# EAGLE design ticktock (EAGLE 6.4)
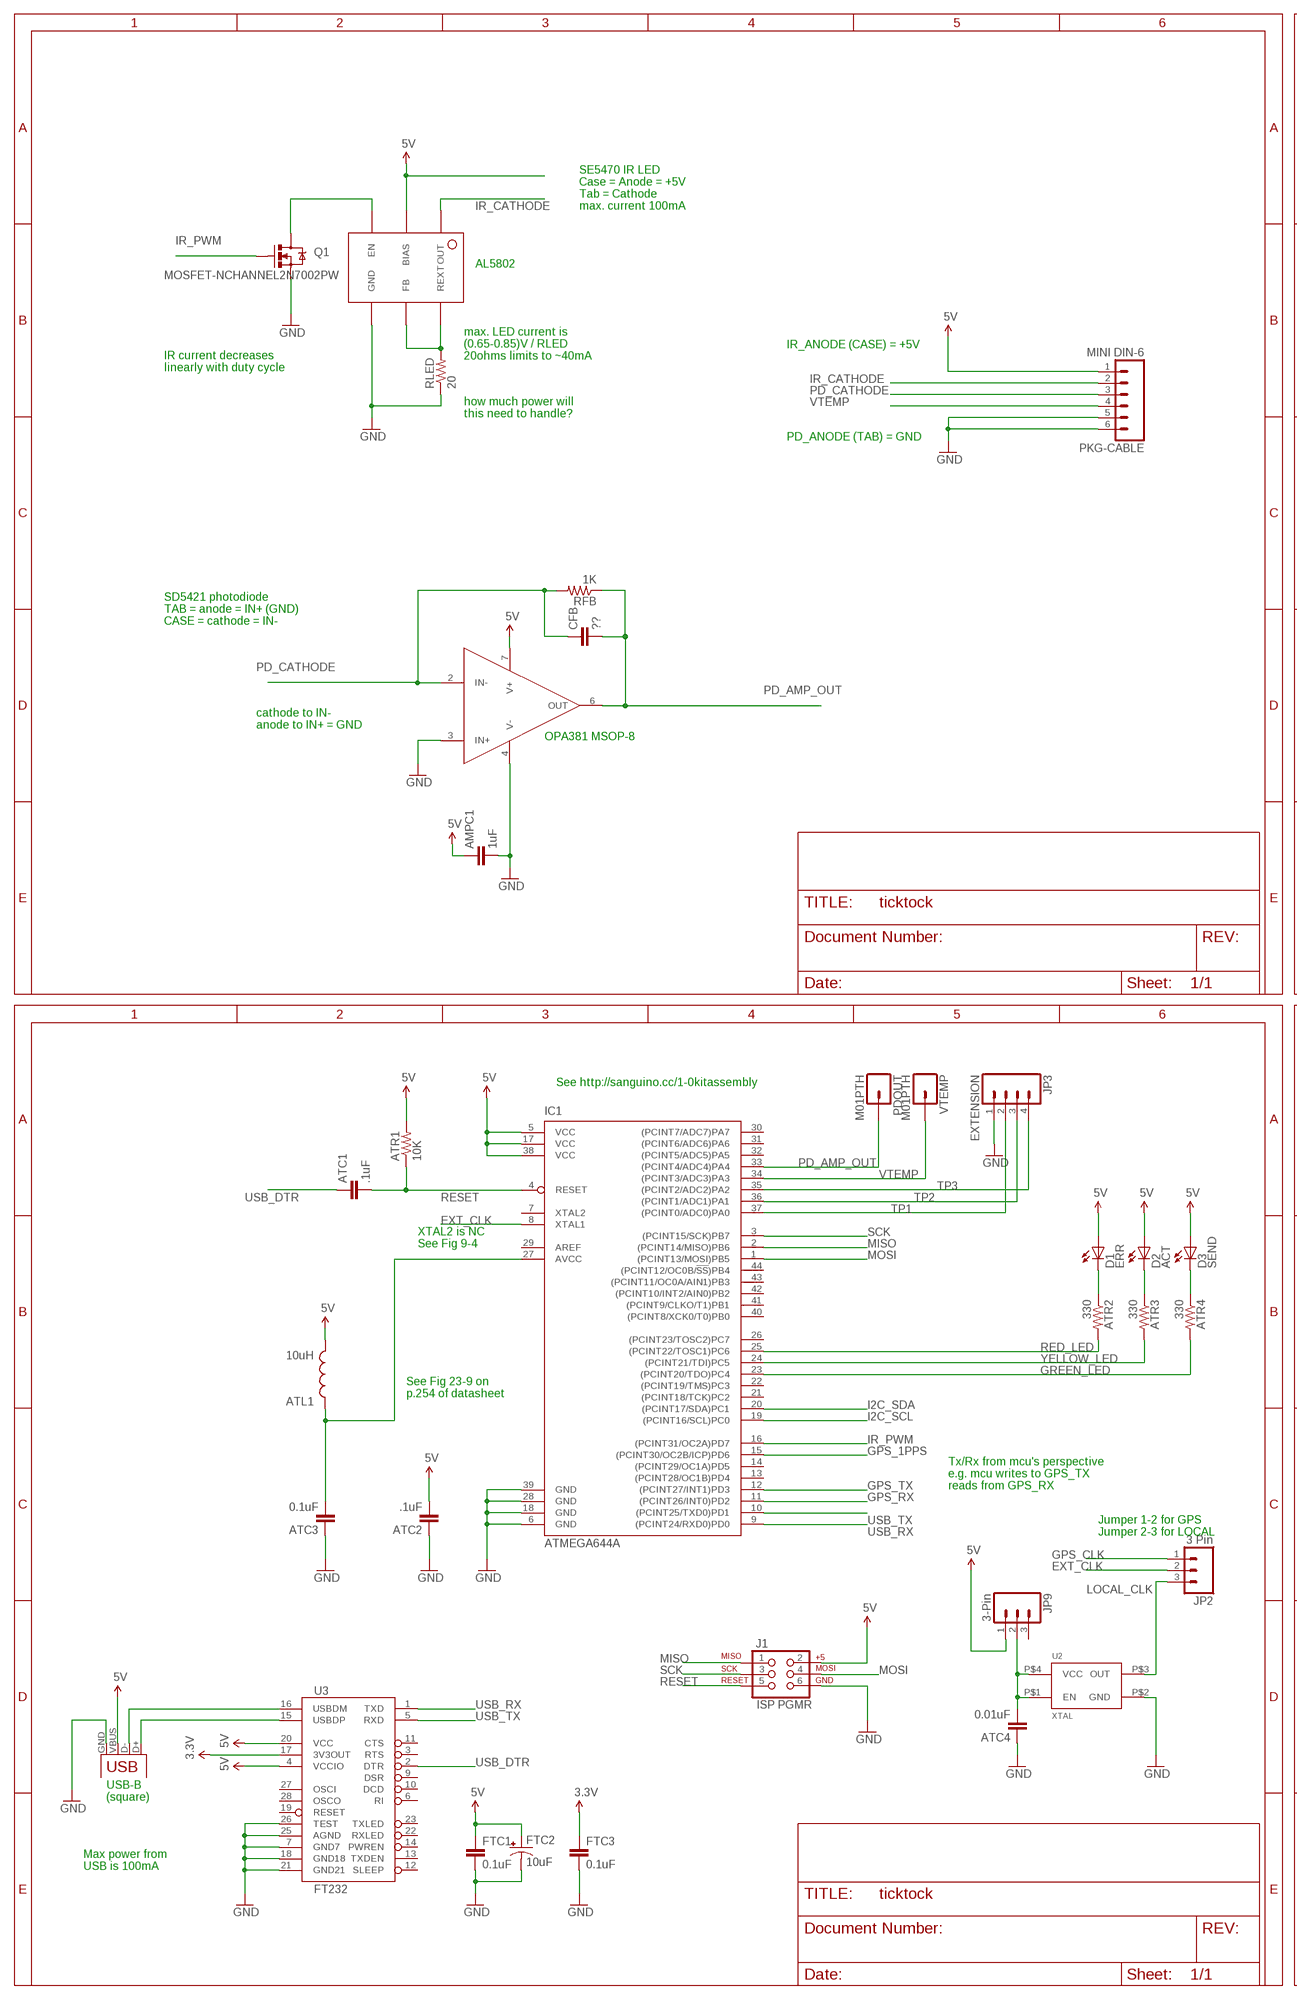
[diagram p0: schematic, sheet 1, part 1 of 2]
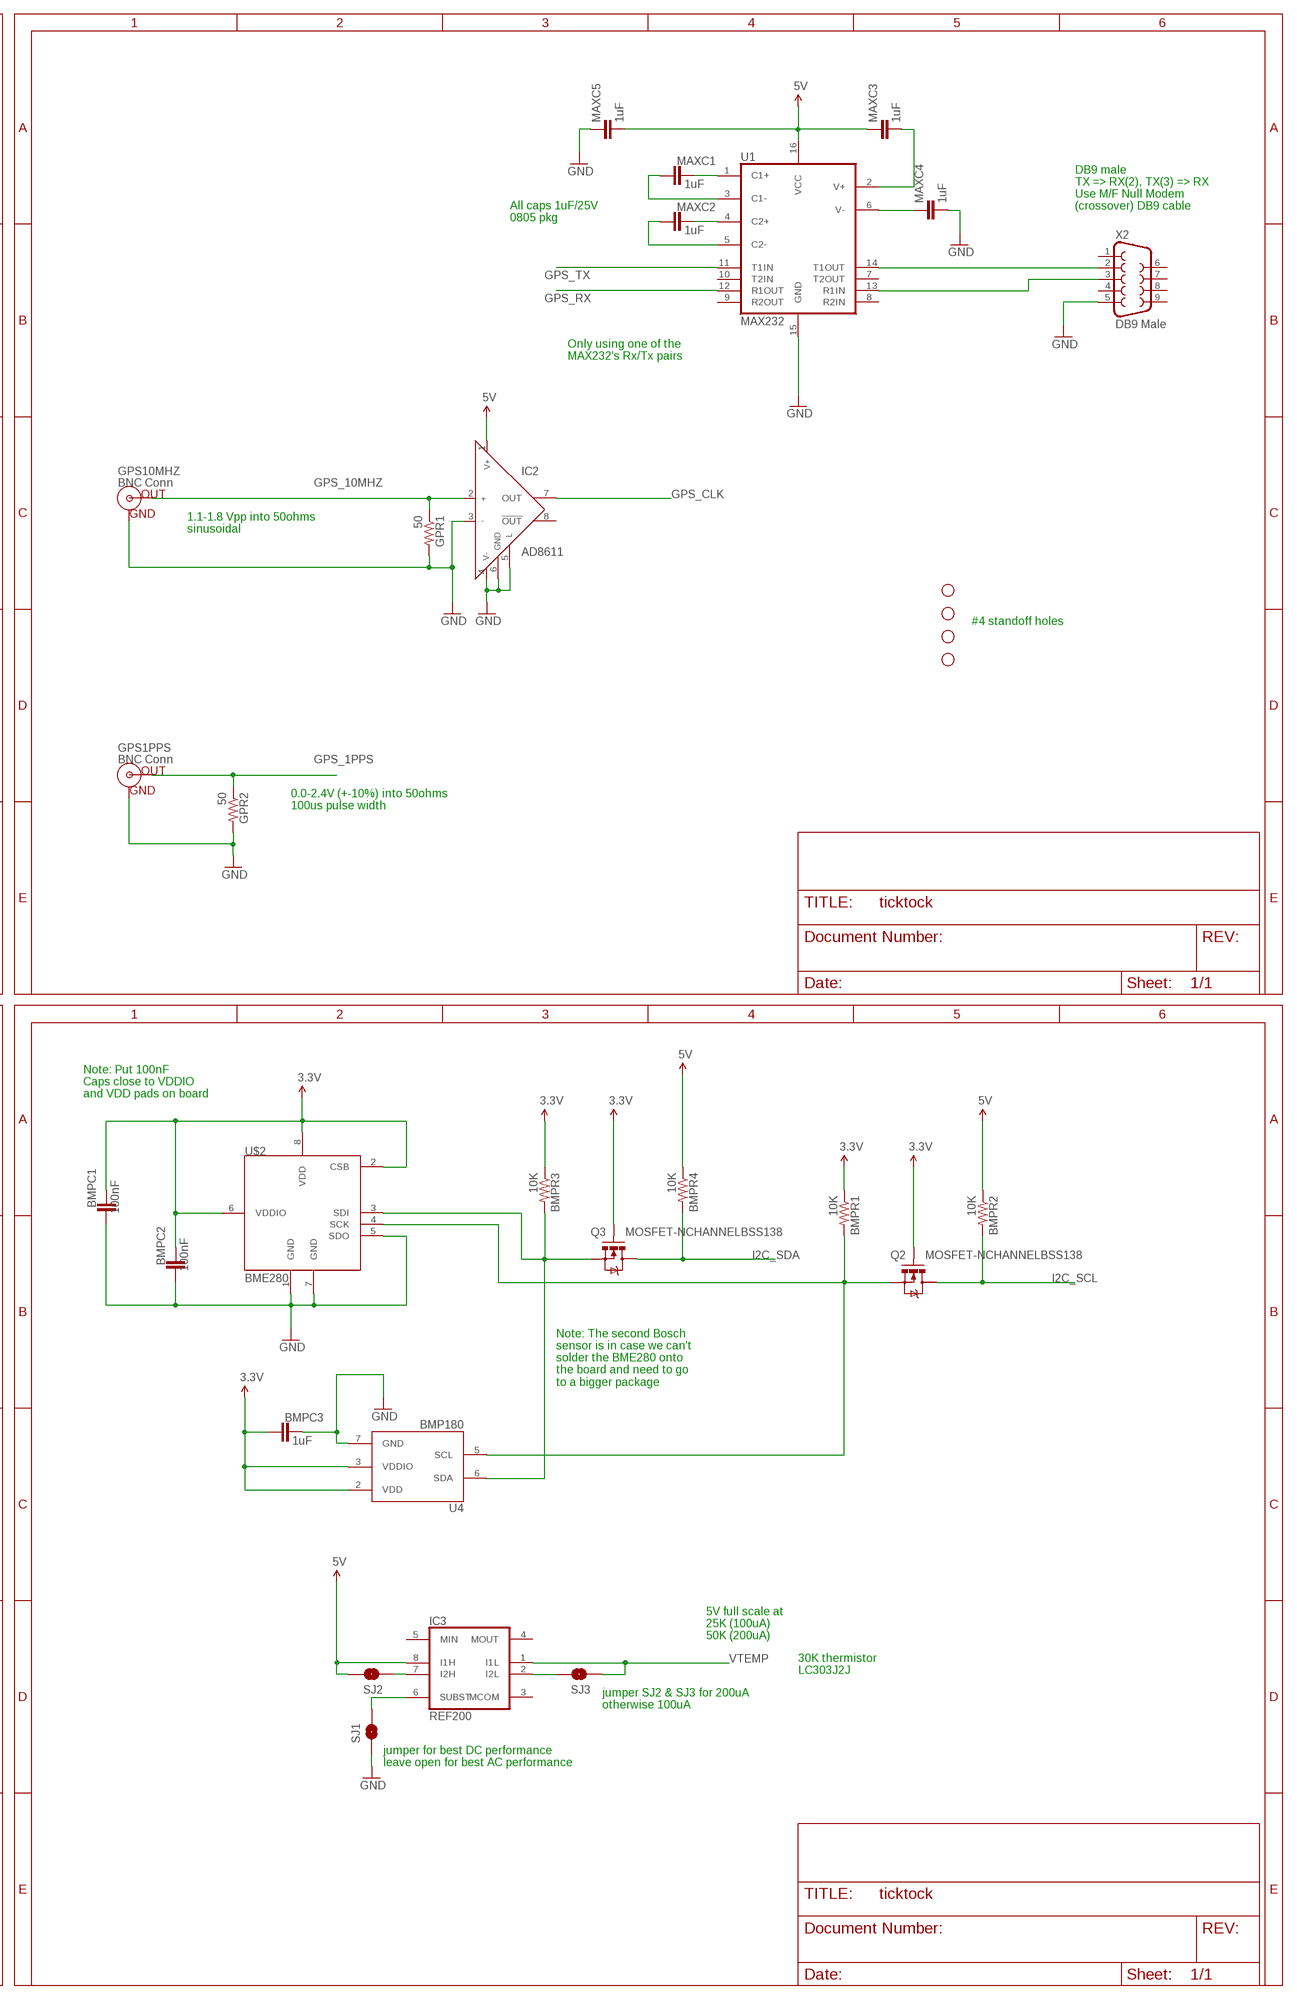
[diagram p1: schematic, sheet 1, part 2 of 2]

## Parts
AMPC1  1uF  CAP0805  [0805]
ATC1  .1uF  CAP0805  [0805]
ATC2  .1uF  CAP0805  [0805]
ATC3  0.1uF  CAP0805  [0805]
ATC4  0.01uF  CAP0805  [0805]
ATL1  10uH  INDUCTOR0805  [0805]
ATR1  10K  RESISTOR0805-RES  [0805]
ATR2  330  RESISTOR0805-RES  [0805]
ATR3  330  RESISTOR0805-RES  [0805]
ATR4  330  RESISTOR0805-RES  [0805]
BMPC1  100nF  CAP0805  [0805]
BMPC2  100nF  CAP0805  [0805]
BMPC3  1uF  CAP0805  [0805]
BMPR1  10K  RESISTOR0805-RES  [0805]
BMPR2  10K  RESISTOR0805-RES  [0805]
BMPR3  10K  RESISTOR0805-RES  [0805]
BMPR4  10K  RESISTOR0805-RES  [0805]
CFB  ??  CAP0805  [0805]
D1  ERR  LED-REDLILYPAD  [LED-1206]
D2  ACT  LED-YELLOWLILYPAD  [LED-1206]
D3  SEND  LED-GREENLILYPAD  [LED-1206]
FTC1  0.1uF  CAP0805  [0805]
FTC2  10uF  CAP_POL1206  [EIA3216]
FTC3  0.1uF  CAP0805  [0805]
GPR1  50  RESISTOR0805-RES  [0805]
GPR2  50  RESISTOR0805-RES  [0805]
GPS1PPS  BNC Conn  BNCPTH  [BNC]
GPS10MHZ  BNC Conn  BNCPTH  [BNC]
IC1  ATMEGA644A  [TQFP44]
IC2  AD8611  AD8611RM  [MSOP08]
IC3  REF200  REF200U  [SO08]
IC4  OPA381  [MSOP08]
IC5  AL5802  AL5802AL5802  [AL5802]
J1  ISP PGMR  AVR_SPI_PRG_6NS  [2X3-NS]
JP1  Square USB  USBPTH  [USB-B-PTH]
JP2  3 Pin  M03LOCK  [1X03_LOCK]
JP3  EXTENSION  M04LOCK  [1X04_LOCK]
JP9  3-Pin  M03LOCK  [1X03_LOCK]
MAXC1  1uF  CAP0805  [0805]
MAXC2  1uF  CAP0805  [0805]
MAXC3  1uF  CAP0805  [0805]
MAXC4  1uF  CAP0805  [0805]
MAXC5  1uF  CAP0805  [0805]
PDOUT  M01PTH  [1X01]
PKG-CABLE  MINI DIN-6  MINI-DIN6PTH  [MINI-DIN6]
Q1  MOSFET-NCHANNEL2N7002PW  [SOT323]
Q2  MOSFET-NCHANNELBSS138  [SOT23]
Q3  MOSFET-NCHANNELBSS138  [SOT23]
RFB  1K  RESISTOR0805-RES  [0805]
RLED  20  RESISTOR0805-RES  [0805]
SJ1  SOLDERJUMPERNO  [SJ_2S-NO]
SJ2  SOLDERJUMPERNO  [SJ_2S-NO]
SJ3  SOLDERJUMPERNO  [SJ_2S-NO]
STANDOFF1  STAND-OFF  [STAND-OFF]
STANDOFF2  STAND-OFF  [STAND-OFF]
STANDOFF3  STAND-OFF  [STAND-OFF]
STANDOFF4  STAND-OFF  [STAND-OFF]
U1  MAX232  MAX232SOIC16  [SO016]
U2  XTAL  OSCILLATORSMD  [CRYSTAL-SMD-7X5]
U3  FT232  FT232RLSSOP  [SSOP28DB]
U4  BMP180  [BMP180]
U$2  BME280  BME280BME280-LGA  [BME280]
VTEMP  M01PTH  [1X01]
X2  DB9 Male  DB9MALE  [DB9_MALE]

## Nets
3.3V: BMPC1.2 BMPC2.2 BMPC3.1 BMPR1.1 BMPR3.1 FTC3.1 Q2.1(G) Q3.1(G) U3.17(3V3OUT) U4.2(VDD) U4.3(VDDIO) U$2.2(CSB) U$2.6(VDDIO) U$2.8(VDD)
5V: AMPC1.1 ATC2.2 ATL1.2 ATR1.2 BMPR2.1 BMPR4.1 D1.A D2.A D3.A FTC1.1 FTC2.A(+) IC1.5(VCC) IC1.17(VCC) IC1.38(VCC) IC2.1(V+) IC3.8(I1H) IC4.7(V+) IC5.BIAS J1.2 JP1.VBUS JP9.1 MAXC3.1 MAXC5.2 PKG-CABLE.1 SJ2.2 U1.16(VCC) U3.4(VCCIO) U3.20(VCC)
EXT_CLK: IC1.8(XTAL1) JP2.2
GND: AMPC1.2 ATC2.1 ATC3.1 ATC4.1 BMPC1.1 BMPC2.1 BMPC3.2 FTC1.2 FTC2.C(-) FTC3.2 GPR1.2 GPR2.2 GPS1PPS.GND GPS10MHZ.GND IC1.6(GND) IC1.18(GND) IC1.28(GND) IC1.39(GND) IC2.3(IN-) IC2.4(V-) IC2.5(L) IC2.6(GND) IC4.3(IN+) IC4.4(V-) IC5.GND J1.6 JP1.GND JP3.1 MAXC4.2 MAXC5.1 PKG-CABLE.5 PKG-CABLE.6 Q1.2(S) RLED.1 SJ1.1 U1.15(GND) U2.P$2(GND) U3.7(GND7) U3.18(GND18) U3.21(GND21) U3.25(AGND) U3.26(TEST) U4.7(GND) U$2.1(GND) U$2.5(SDO) U$2.7(GND) X2.5
GPS_1PPS: GPR2.1 GPS1PPS.S(OUT) IC1.15((PCINT30/OC2B/ICP)PD6)
GPS_10MHZ: GPR1.1 GPS10MHZ.S(OUT) IC2.2(IN+)
GPS_CLK: IC2.7(OUT) JP2.1
GPS_RX: IC1.11((PCINT26/INT0)PD2) U1.12(R1OUT)
GPS_TX: IC1.12((PCINT27/INT1)PD3) U1.11(T1IN)
GREEN_LED: ATR4.2 IC1.23((PCINT20/TDO)PC4)
I2C_SCL: BMPR2.2 IC1.19((PCINT16/SCL)PC0) Q2.3(D)
I2C_SDA: BMPR4.2 IC1.20((PCINT17/SDA)PC1) Q3.3(D)
IR_CATHODE: IC5.OUT PKG-CABLE.2
IR_PWM: IC1.16((PCINT31/OC2A)PD7) Q1.1(G)
LOCAL_CLK: JP2.3 U2.P$3(OUT)
MISO: IC1.2((PCINT14/MISO)PB6) J1.1
MOSI: IC1.1((PCINT13/MOSI)PB5) J1.4
N$1: IC5.EN Q1.3(D)
N$2: IC5.FB IC5.REXT RLED.2
N$3: MAXC1.2 U1.1(C1+)
N$4: MAXC1.1 U1.3(C1-)
N$5: MAXC2.2 U1.4(C2+)
N$6: MAXC2.1 U1.5(C2-)
N$7: MAXC3.2 U1.2(V+)
N$8: U1.14(T1OUT) X2.2
N$9: MAXC4.1 U1.6(V-)
N$10: U1.13(R1IN) X2.3
N$11: JP1.D- U3.16(USBDM)
N$12: JP1.D+ U3.15(USBDP)
N$13: ATC3.2 ATL1.1 IC1.27(AVCC)
N$14: IC3.6(SUBST) SJ1.2
N$15: BMPR1.2 Q2.2(S) U4.5(SCL) U$2.4(SCK)
N$16: ATR4.1 D3.C
N$17: IC3.7(I2H) SJ2.1
N$19: IC3.2(I2L) SJ3.2
N$20: ATR3.1 D2.C
N$21: ATR2.1 D1.C
N$22: ATC4.2 JP9.2 U2.P$1(EN) U2.P$4(VCC)
N$23: BMPR3.2 Q3.2(S) U4.6(SDA) U$2.3(SDI)
PD_AMP_OUT: CFB.2 IC1.33((PCINT4/ADC4)PA4) IC4.6(OUT) PDOUT.1 RFB.1
PD_CATHODE: CFB.1 IC4.2(IN-) PKG-CABLE.3 RFB.2
RED_LED: ATR2.2 IC1.25((PCINT22/TOSC1)PC6)
RESET: ATC1.2 ATR1.1 IC1.4(RESET) J1.5
SCK: IC1.3((PCINT15/SCK)PB7) J1.3
TP1: IC1.37((PCINT0/ADC0)PA0) JP3.2
TP2: IC1.36((PCINT1/ADC1)PA1) JP3.3
TP3: IC1.35((PCINT2/ADC2)PA2) JP3.4
USB_DTR: ATC1.1 U3.2(DTR)
USB_RX: IC1.9((PCINT24/RXD0)PD0) U3.1(TXD)
USB_TX: IC1.10((PCINT25/TXD0)PD1) U3.5(RXD)
VTEMP: IC1.34((PCINT3/ADC3)PA3) IC3.1(I1L) PKG-CABLE.4 SJ3.1 VTEMP.1
YELLOW_LED: ATR3.2 IC1.24((PCINT21/TDI)PC5)
Unconnected: IC1.7(XTAL2) IC1.13((PCINT28/OC1B)PD4) IC1.14((PCINT29/OC1A)PD5) IC1.21((PCINT18/TCK)PC2) IC1.22((PCINT19/TMS)PC3) IC1.26((PCINT23/TOSC2)PC7) IC1.29(AREF) IC1.30((PCINT7/ADC7)PA7) IC1.31((PCINT6/ADC6)PA6) IC1.32((PCINT5/ADC5)PA5) IC1.40((PCINT8/XCK0/T0)PB0) IC1.41((PCINT9/CLKO/T1)PB1) IC1.42((PCINT10/INT2/AIN0)PB2) IC1.43((PCINT11/OC0A/AIN1)PB3) IC1.44((PCINT12/OC0B/!SS!)PB4) IC2.8(!OUT) IC3.3(MCOM) IC3.4(MOUT) IC3.5(MIN) JP9.3 U1.7(T2OUT) U1.8(R2IN) U1.9(R2OUT) U1.10(T2IN) U3.3(RTS) U3.6(RI) U3.9(DSR) U3.10(DCD) U3.11(CTS) U3.12(SLEEP) U3.13(TXDEN) U3.14(PWREN) U3.19(RESET) U3.22(RXLED) U3.23(TXLED) U3.27(OSCI) U3.28(OSCO) X2.1 X2.4 X2.6 X2.7 X2.8 X2.9

## Notes on the sheet
- SE5470 IR LED
  Case = Anode = +5V
  Tab = Cathode
  max. current 100mA
- DB9 male 
  TX => RX(2), TX(3) => RX
  Use M/F Null Modem 
  (crossover) DB9 cable
- All caps 1uF/25V
  0805 pkg
- AL5802
- IR_ANODE (CASE) = +5V
- max. LED current is
  (0.65-0.85)V / RLED
  20ohms limits to ~40mA
- Only using one of the
  MAX232's Rx/Tx pairs
- IR current decreases
  linearly with duty cycle
- how much power will
  this need to handle?
- PD_ANODE (TAB) = GND
- 1.1-1.8 Vpp into 50ohms
  sinusoidal
- SD5421 photodiode
  TAB = anode = IN+ (GND)
  CASE = cathode = IN-
- #4 standoff holes
- cathode to IN-
  anode to IN+ = GND
- OPA381 MSOP-8
- 0.0-2.4V (+-10%) into 50ohms
  100us pulse width
- See http://sanguino.cc/1-0kitassembly
- Note: Put 100nF
  Caps close to VDDIO
  and VDD pads on board
- XTAL2 is NC
  See Fig 9-4
- Note: The second Bosch
  sensor is in case we can't
  solder the BME280 onto
  the board and need to go
  to a bigger package
- See Fig 23-9 on
  p.254 of datasheet
- Tx/Rx from mcu's perspective
  e.g. mcu writes to GPS_TX
  reads from GPS_RX
- Jumper 1-2 for GPS
  Jumper 2-3 for LOCAL
- 5V full scale at
  25K (100uA)
  50K (200uA)
- 30K thermistor
  LC303J2J
- jumper SJ2 & SJ3 for 200uA
  otherwise 100uA
- jumper for best DC performance
  leave open for best AC performance
- USB-B
  (square)
- Max power from
  USB is 100mA

## Library data of the parts
AMPC1 ATC1-ATC4 BMPC1-BMPC3 CFB FTC1 FTC3 MAXC1-MAXC5 = SparkFun-Capacitors:CAP: Capacitor Standard 0603 ceramic capacitor, and 0.1" leaded capacitor.
ATL1 = SparkFun-Passives:INDUCTOR: Inductors Basic Inductor/Choke - 0603 and 1206. Footprints are not proven and vary greatly between part numbers. SRN6045- 33uH, 20% 1.4A SDR0403-560KL - 56uH, 10%, 500mA RMS/740mA peak
ATR1-ATR4 BMPR1-BMPR4 GPR1 GPR2 RFB RLED = SparkFun-Resistors:RESISTOR: Resistor Basic schematic elements and footprints for 0603, 1206, and PTH resistors.
D1 = SparkFun-LED:LED-RED: Assorted Red LEDs LilyPad 1206- DIO-09912 1206- DIO-00809 0603- DIO-00819; PROD_ID: DIO-09912; VALUE: RED
D2 = SparkFun-LED:LED-YELLOW: Yellow SMD LEDs LilyPad 1206- DIO-09909 0603- DIO-09003; PROD_ID: DIO-09909; VALUE: Yellow
D3 = SparkFun-LED:LED-GREEN: Various green LEDs 0603- DIO-00821 LARGE- DIO-00862 LILYPAD- DIO-09910; PROD_ID: DIO-09910; VALUE: GREEN
FTC2 = SparkFun-Capacitors:CAP_POL: Capacitor Polarized These are standard SMD and PTH capacitors. Normally 10uF, 47uF, and 100uF in electrolytic and tantalum varieties. Always verify the external diameter of the through hole cap, it varies with capacity, voltage, and manufacturer. The EIA devices should be standard.
GPS1PPS GPS10MHZ = SparkFun-Connectors:BNC: BNC Connector, Mouser Part# 5227161
IC1 = atmel:ATMEGA644: 8-bit Microcontroller with 64K Bytes In-System Programmable Flash Source: http://www.atmel.com/dyn/resources/prod_documents/doc2593.pdf; MPN: ATMEGA644PV-10AU; OC_FARNELL: 1455123; OC_NEWARK: 58M3748
IC2 = analog-devices:AD8611: Ultrafast 4 ns Single Supply Comparators Source: http://www.analog.com/UploadedFiles/Data_Sheets/703465986AD8611_2_0.pdf Upgrade for LT1394 and LT1016 Designs; MPN: AD8611ARMZ-R2; OC_FARNELL: 1464995; OC_NEWARK: 19M8930
IC3 = burr-brown:REF200: Dual Current Source/Current Sink; MF: TEXAS INSTRUMENTS; MPN: REF200AU; OC_FARNELL: 1207240; OC_NEWARK: 34C7615
IC4 = tickTockLibrary:OPA381
IC5 = tickTockLibrary:AL5802
J1 = SparkFun-Connectors:AVR_SPI_PRG_6: AVR ISP 6 Pin This is the reduced ISP connector for AVR programming. Common on Arduino. This footprint will take up less PCB space and can be used with a 10-pin to 6-pin adapter such as SKU: BOB-08508
JP1 = SparkFun-Connectors:USB: USB Connectors USB-B-PTH is fully proven SKU : PRT-00139/CONN-08278 USB-miniB is fully proven SKU : PRT-00587 USB-A-PCB is untested. USB-A-H is throughly reviewed, but untested. Spark Fun Electronics SKU : PRT-00437 USB-B-SMT is throughly reviewed, but untested. Needs silkscreen touching up. USB-A-S has not been used/tested USB-MB-H has not been used/tested USB-MICROB has been used. CONN-09505; PROD_ID: CONN-08278; VALUE: USB-B
JP2 JP9 = SparkFun-Connectors:M03: Header 3 Standard 3-pin 0.1" header. Use with straight break away headers (SKU : PRT-00116), right angle break away headers (PRT-00553), swiss pins (PRT-00743), machine pins (PRT-00117), and female headers (PRT-00115). Molex polarized connector foot print use with SKU : PRT-08232 with associated crimp pins and housings.
JP3 = SparkFun-Connectors:M04: Header 4 Standard 4-pin 0.1" header. Use with straight break away headers (SKU : PRT-00116), right angle break away headers (PRT-00553), swiss pins (PRT-00743), machine pins (PRT-00117), and female headers (PRT-00115). Molex polarized connector foot print use with SKU : PRT-08231 with associated crimp pins and housings. 1MM SMD Version SKU: PRT-10208
PDOUT VTEMP = SparkFun-Connectors:M01: Header 1 Standard 1-pin 0.1" header. Use with straight break away headers (SKU : PRT-00116), right angle break away headers (PRT-00553), swiss pins (PRT-00743), machine pins (PRT-00117), and female headers (PRT-00115).
PKG-CABLE = SparkFun-Connectors:MINI-DIN6: mini DIN 6 Connector Commonly found on the back of a computer for PS2 keyboard and mice. Schematic and footprint are proven. Spark Fun Electronics SKU : PRT-08509
Q1 = SparkFun-DiscreteSemi:MOSFET-NCHANNEL: Common NMOSFET Parts MFG P/N Store ID Prod ID FDD8780 TRANS-09984 SI7820DN TRANS-11055 FDS6630A IC-08089 2N7002PW TRANS-11151 FQP30N06L COM-10213 TRANS-10060 BSS123LT1G TRANS-08345 BSS138 TRANS-00830 BS170 2N7000; PROD_ID: TRANS-11151
Q2 Q3 = SparkFun-DiscreteSemi:MOSFET-NCHANNEL: Common NMOSFET Parts MFG P/N Store ID Prod ID FDD8780 TRANS-09984 SI7820DN TRANS-11055 FDS6630A IC-08089 2N7002PW TRANS-11151 FQP30N06L COM-10213 TRANS-10060 BSS123LT1G TRANS-08345 BSS138 TRANS-00830 BS170 2N7000; PROD_ID: TRANS-00830
SJ1-SJ3 = SparkFun:SOLDERJUMPER: Solder Jumper Standard SMD solder jumper. Used to automate production. Two varients : Normally Open and Normally Closed are the same, but have different paste layers. NC will have a large amount of paste and should jumper during reflow.
STANDOFF1-STANDOFF4 = SparkFun-Electromechanical:STAND-OFF: #4 Stand Off This is the mechanical footprint for a #4 phillips button head screw. Use the keepout ring to avoid running the screw head into surrounding components. SKU : PRT-00447
U1 = SparkFun-DigitalIC:MAX232: RS232 Transceiver Very common IC. This is generically called 'MAX232', but works with the 3V equivalent MAX3232 generic ICs. Field tested and mother approved. Spark Fun Electronics SKU : COM-00316 (DIP) and COM-00589 (SMD)
U2 = SparkFun-FreqCtrl:OSCILLATOR: Generic 5x3 and 7x5 oscillators
U3 = SparkFun-DigitalIC:FT232RL: USB UART FT232RL 4th Generation USB UART (USB <-> Serial) Controller. Spark Fun Electronics SKU : COM-00650 Production SKU IC-00870; PROD_ID: IC-00870
U4 = SparkFun-Sensors:BMP180: BOSCH BMP180 DIGITAL BAROMETRIC PRESSURE SENSOR Web page: http://www.bosch-sensortec.com/en/homepage/products_3/environmental_sensors_1/bmp180_1/bmp180 Datasheet: http://ae-bst.resource.bosch.com/media/products/dokumente/bmp180/BST-BMP180-DS000-09.pdf The BMP180 is the function compatible successor of the BMP085, a new generation of high precision digital pressure sensors for consumer applications. The ultra-low power, low voltage electronics of the BMP180 is optimized for use in mobile phones, PDAs, GPS navigation devices and outdoor equipment. With a low altitude noise of merely 0.25m at fast conversion time, the BMP180 offers superior performance. The I2C interface allows for easy system integration with a microcontroller. The BMP180 is based on piezo-resistive technology for EMC robustness, high accuracy and linearity as well as long term stability. Key features: - Temperature measurement included - I2C interface - Fully calibrated - Pb-free, halogen-free and RoHS compliant, - MSL 1 Basic specs: Pressure range: 300 to 1100hPa (+9000m to -500m relating to sea level) Supply voltage: 1.8 to 3.6V (VDD), 1.62V to 3.6V (VDDIO) Package: LGA package with metal lid Small footprint: 3.6mm x 3.8mm Super-flat: 0.93mm height Low power: 5μA at 1 sample / sec. in standard mode Low noise: 0.06hPa (0.5m) in ultra low power mode, 0.02hPa (0.17m) advanced resolution mode Typical applications: - Enhancement of GPS navigation (dead-reckoning, slope detection, etc.) - In- and out-door navigation - Leisure and sports - Weather forecast - Vertical velocity indication (rise/sink speed)
U$2 = tickTockLibrary:BME280
X2 = SparkFun-Connectors:DB9: DB9 Connector Standard DB9 (D-Sub 9) serial connector. Can be used for CAN bus as well as RS485 and RS232. Footprint production proven. Spark Fun Electronics SKU : PRT-00429

## Board
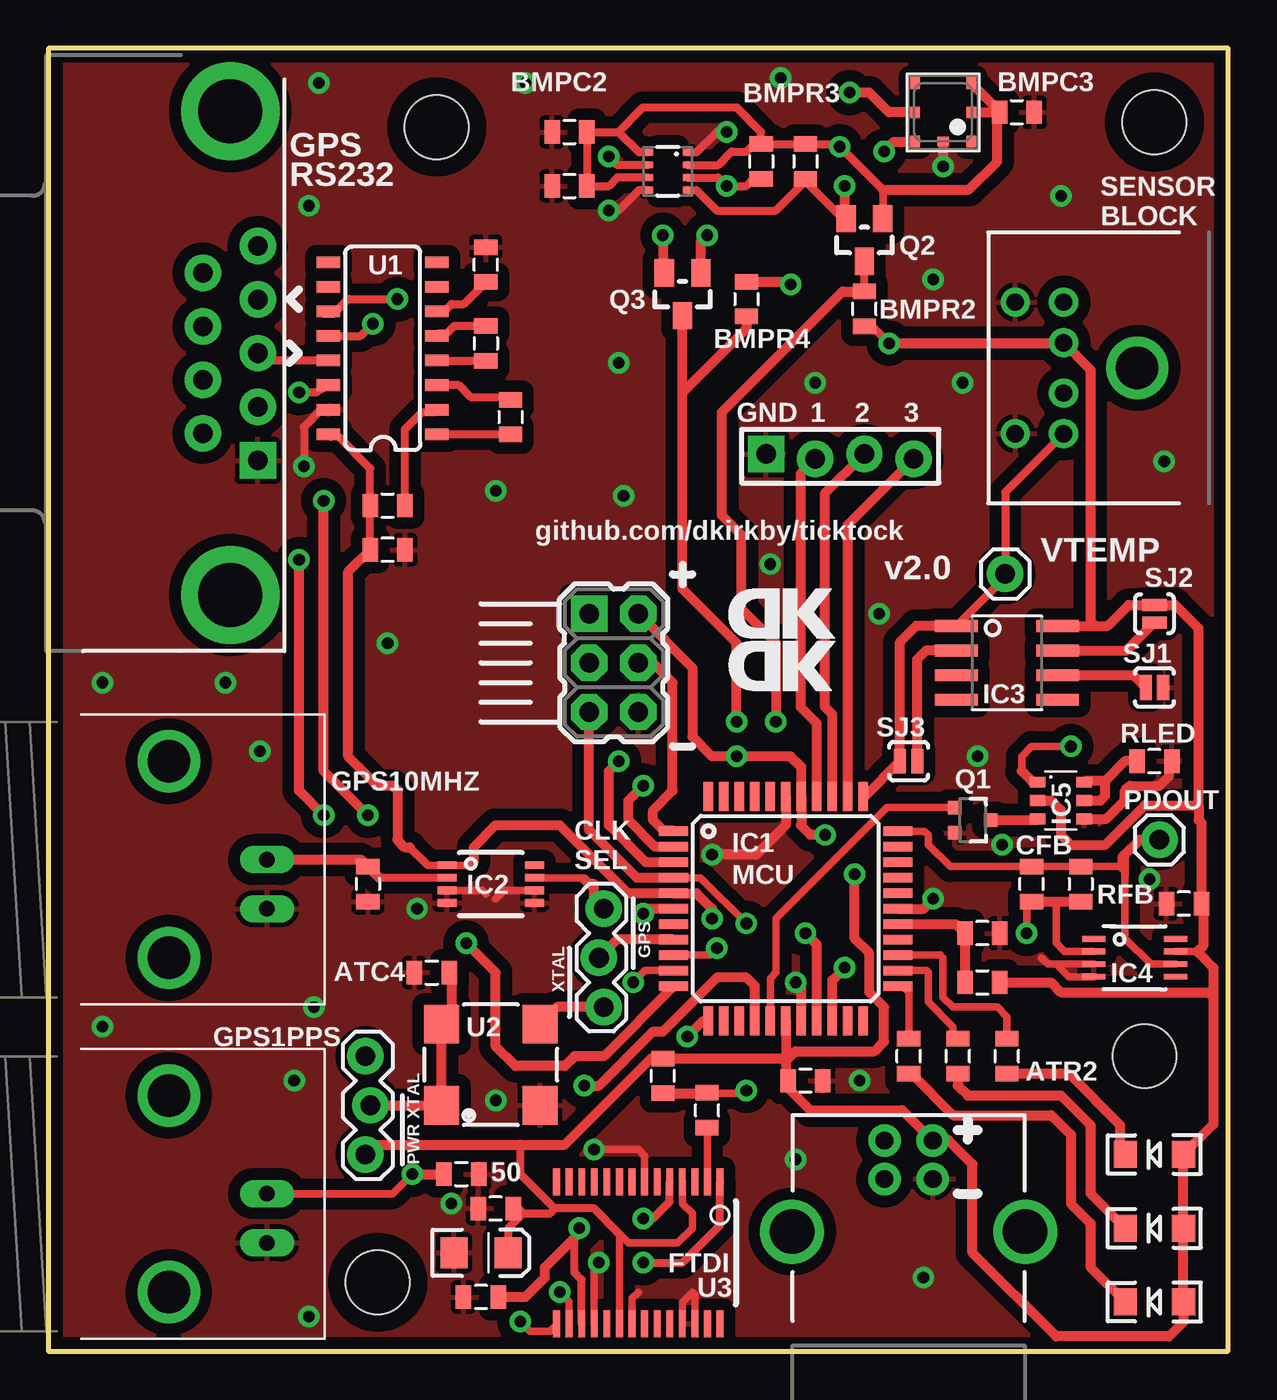
[diagram p2: board, top side]
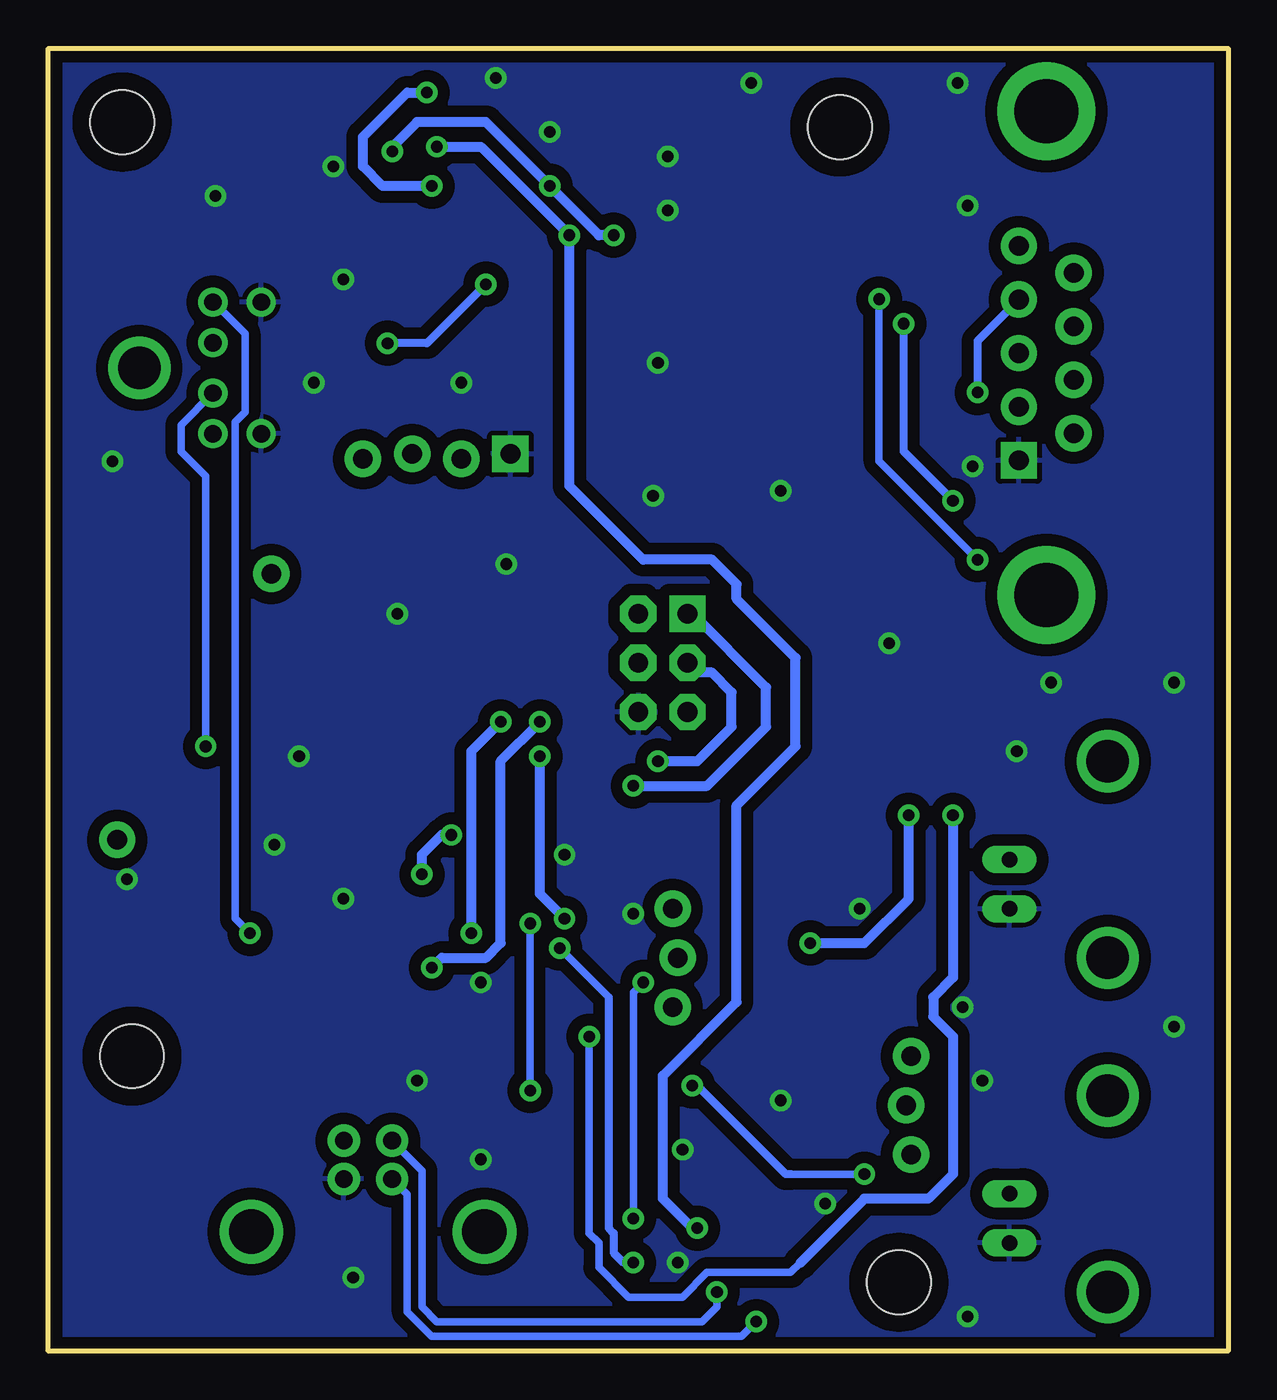
[diagram p3: board, bottom side, seen from below]

Size 60.96 x 67.31 mm. Coordinates in mm from the lower left corner, seen from the top.
Outline: 0,0 60.96,0 60.96,67.31 0,67.31 0,0
Copper layers (1*16): Top 0.035mm / dielectric 1.5mm / Bottom 0.035mm
Design rules "SparkFun": minimum track width 8mil, minimum drill 20mil, track to track 8mil, track to pad 8mil, pad to pad 8mil, via to via 8mil, smd to smd 8mil, copper to edge 10mil, drill to drill 8mil, minimum pad ring 12mil, minimum via ring 10mil, stop-mask expansion 4mil, vias tented up to drill 25mil, thermal gap 10mil
tRestrict: area 31.5,59.7 to 32.5,62.2; area 45.2,63 to 47.2,65.8

### Footprints (pad centres in the part's own frame; a part is rotated, then mirrored left to right if it is on the bottom)
0805 = smd 0.8 x 1.2: 1 -0.9,0; 2 0.9,0
LED-1206 = smd 1.2 x 1.4: A -1.5,0; C 1.5,0
EIA3216 = smd 1.4 x 1.6: A 1.4,0; C -1.4,0
BNC = drill 2.2: 3 -5.08,5.08; 4 5.08,5.08 | drill 0.8 long: GND -2.54,0; S 0,0
TQFP44 = smd 1.5 x 0.5: 1 -5.8,4; 2 -5.8,3.2; 3 -5.8,2.4; 4 -5.8,1.6; 5 -5.8,0.8; 6 -5.8,0; 7 -5.8,-0.8; 8 -5.8,-1.6; 9 -5.8,-2.4; 10 -5.8,-3.2; 11 -5.8,-4; 23 5.8,-4; 24 5.8,-3.2; 25 5.8,-2.4; 26 5.8,-1.6; 27 5.8,-0.8; 28 5.8,0; 29 5.8,0.8; 30 5.8,1.6; 31 5.8,2.4; 32 5.8,3.2; 33 5.8,4 | smd 0.5 x 1.5: 12 -4,-5.8; 13 -3.2,-5.8; 14 -2.4,-5.8; 15 -1.6,-5.8; 16 -0.8,-5.8; 17 0,-5.8; 18 0.8,-5.8; 19 1.6,-5.8; 20 2.4,-5.8; 21 3.2,-5.8; 22 4,-5.8; 34 4,5.8; 35 3.2,5.8; 36 2.4,5.8; 37 1.6,5.8; 38 0.8,5.8; 39 0,5.8; 40 -0.8,5.8; 41 -1.6,5.8; 42 -2.4,5.8; 43 -3.2,5.8; 44 -4,5.8
MSOP08 = smd 0.4 x 1: 1 -0.976,-2.263; 2 -0.326,-2.263; 3 0.324,-2.263; 4 0.974,-2.263; 5 0.974,2.262; 6 0.324,2.262; 7 -0.326,2.262; 8 -0.976,2.262
SO08 = smd 0.61 x 2.21: 1 -1.905,-2.616; 2 -0.635,-2.616; 3 0.635,-2.616; 4 1.905,-2.616; 5 1.905,2.616; 6 0.635,2.616; 7 -0.635,2.616; 8 -1.905,2.616
MSOP08' = smd 0.3 x 1.2: 1 -0.976,-2.113; 2 -0.326,-2.113; 3 0.324,-2.113; 4 0.974,-2.113; 5 0.974,2.112; 6 0.324,2.112; 7 -0.326,2.112; 8 -0.976,2.112
AL5802 = smd 0.55 x 0.8: BIAS 0,-1.2; EN 0.95,-1.2; FB 0,1.2; GND 0.95,1.2; OUT -0.95,-1.2; REXT -0.95,1.2
2X3-NS = drill 1.016 pad 1.88 square: 1 -2.54,-1.27 | drill 1.016 pad 1.88 octagon: 2 -2.54,1.27; 3 0,-1.27; 4 0,1.27; 5 2.54,-1.27; 6 2.54,1.27
USB-B-PTH = drill 0.914 pad 1.676: D+ 0,1.25; D- 1.981,1.25; GND 0,-1.25; VBUS 1.981,-1.25 | drill 2.286: S1 -2.718,-6.02; S2 -2.718,6.02
1X03_LOCK = drill 1.016 pad 1.88: 1 0,0.127; 2 2.54,-0.127; 3 5.08,0.127
1X04_LOCK = drill 1.016 pad 1.88 square: 1 0,0.127 | drill 1.016 pad 1.88: 2 2.54,-0.127; 3 5.08,0.127; 4 7.62,-0.127
1X01 = drill 1.016 pad 1.88: 1 0,0
MINI-DIN6 = drill 0.9: 1 -1.3,-8.5; 2 1.3,-8.5; 3 -3.4,-8.5; 4 3.4,-8.5; 5 -3.4,-11; 6 3.4,-11 | drill 2.2: P$1 0,-4.7
SOT323 = smd 0.7 x 0.7: 1 -0.65,-0.925; 2 0.65,-0.925; 3 0,0.925
SOT23 = smd 1 x 1.4: 1 -0.95,-1.1; 2 0.95,-1.1; 3 0,1.1
SJ_2S-NO = smd 0.635 x 1.27: 1 -0.45,0; 2 0.45,0
STAND-OFF = hole 3.302: 0,0
SO016 = smd 0.6 x 1.2: 1 -4.445,-2.8; 2 -3.175,-2.8; 3 -1.905,-2.8; 4 -0.635,-2.8; 5 0.635,-2.8; 6 1.905,-2.8; 7 3.175,-2.8; 8 4.445,-2.8; 9 4.445,2.8; 10 3.175,2.8; 11 1.905,2.8; 12 0.635,2.8; 13 -0.635,2.8; 14 -1.905,2.8; 15 -3.175,2.8; 16 -4.445,2.8
CRYSTAL-SMD-7X5 = smd 1.8 x 2: P$1 0,0; P$2 5.08,0; P$3 5.08,4.2; P$4 0,4.2
SSOP28DB = smd 0.348 x 1.397: 1 -4.225,-3.656; 2 -3.575,-3.656; 3 -2.925,-3.656; 4 -2.275,-3.656; 5 -1.625,-3.656; 6 -0.975,-3.656; 7 -0.325,-3.656; 8 0.325,-3.656; 9 0.975,-3.656; 10 1.625,-3.656; 11 2.275,-3.656; 12 2.925,-3.656; 13 3.575,-3.656; 14 4.225,-3.656; 15 4.225,3.656; 16 3.575,3.656; 17 2.925,3.656; 18 2.275,3.656; 19 1.625,3.656; 20 0.975,3.656; 21 0.325,3.656; 22 -0.325,3.656; 23 -0.975,3.656; 24 -1.625,3.656; 25 -2.275,3.656; 26 -2.925,3.656; 27 -3.575,3.656; 28 -4.225,3.656
BMP180 = smd 0.6 x 0.5: 1 1.5,1.45; 2 0,1.45; 3 -1.5,1.45; 4 -1.5,-1.45; 5 0,-1.45; 6 1.5,-1.45 | smd 0.5 x 0.6: 7 1.5,0
BME280 = smd 0.5 x 0.35: 1 1.025,0.975; 2 1.025,0.325; 3 1.025,-0.325; 4 1.025,-0.975; 5 -1.025,-0.975; 6 -1.025,-0.325; 7 -1.025,0.325; 8 -1.025,0.975
DB9_MALE = drill 1.016 pad 1.88: 1 5.54,-1.42; 2 2.77,-1.42; 3 0,-1.42; 4 -2.77,-1.42; 6 4.15,1.42; 7 1.38,1.42; 8 -1.38,1.42; 9 -4.15,1.42 | drill 1.016 pad 1.88 square: 5 -5.54,-1.42 | drill 3.302 pad 5.08: G1 -12.5,0; G2 12.5,0

### Placement (x,y rotation side)
AMPC1  58.67,23.11 180 top
ATC1  34.04,12.45 90 top
ATC2  39.12,13.97 180 top
ATC3  48.26,21.59 180 top
ATC4  19.81,19.56 0 top
ATL1  48.26,19.05 0 top
ATR1  31.75,14.22 90 top
ATR2  49.53,15.24 90 top
ATR3  46.99,15.24 90 top
ATR4  44.45,15.24 90 top
BMPC1  26.92,60.2 0 top
BMPC2  26.92,62.99 0 top
BMPC3  50.04,64.01 0 top
BMPR1  39.12,61.47 270 top
BMPR2  42.16,53.85 90 top
BMPR3  36.83,61.47 270 top
BMPR4  36.07,54.36 270 top
CFB  50.8,24.13 90 top
D1  57.15,10.16 180 top
D2  57.15,6.35 180 top
D3  57.15,2.54 180 top
FTC1  23.11,7.37 180 top
FTC2  22.35,5.08 0 top
FTC3  22.35,2.79 180 top
GPR1  16.51,24.13 270 top
GPR2  21.34,9.14 0 top
GPS1PPS  11.3,8.13 90 top
GPS10MHZ  11.3,25.4 90 top
IC1  38.1,22.86 0 top
IC2  22.86,24.13 270 top
IC3  49.53,35.56 270 top
IC4  OPA381  [MSOP08']  56.13,20.32 270 top
IC5  52.32,28.45 270 top
J1  29.21,35.56 270 top
JP1  44.45,8.89 90 top
JP2  28.57,22.86 270 top
JP3  37.08,46.23 0 top
JP9  16.51,10.16 90 top
MAXC1  23.88,48.26 270 top
MAXC2  22.61,52.07 270 top
MAXC3  17.53,43.69 0 top
MAXC4  22.61,56.13 90 top
MAXC5  17.53,41.4 180 top
PDOUT  57.4,26.42 0 top
PKG-CABLE  60.96,50.8 270 top
Q1  47.75,27.43 270 top
Q2  42.16,57.4 180 top
Q3  32.77,54.61 180 top
RFB  53.34,24.13 270 top
RLED  57.15,30.48 180 top
SJ1  57.15,34.29 180 top
SJ2  57.15,38.1 90 top
SJ3  44.45,30.48 0 top
STANDOFF1  57.15,63.5 0 top
STANDOFF2  20.07,63.25 0 top
STANDOFF3  56.64,15.24 0 top
STANDOFF4  17.02,3.56 0 top
U1  17.27,51.82 90 top
U2  20.32,12.7 0 top
U3  30.48,5.08 180 top
U4  46.23,64.01 270 top
U$2  32,60.96 0 top
VTEMP  49.44,40.16 0 top
X2  9.4,51.56 90 top

### Tracks (layer width: path | path; a pad name or v marks a point on that pad's centre or on a via)
3.3V  (via drill 0.6)
  Top 0.406: U$2.2 34.62,61.28 35.31,61.98 36.07,61.98 36.46,62.37 BMPR3.1 | U$2.8 30.52,61.94 29.46,62.99 | U$2.6 29.39,60.63 28.96,60.2 BMPC1.2 BMPC2.2 29.46,62.99 | BMPR3.1 BMPR1.1 | BMPR1.1 39.12,62.48 | 29.46,62.99 30.73,64.26 35.56,64.26 36.83,62.99 BMPR3.1 | BMPR1.1 40.76,62.37 v40.89,62.23 43.11,60.01 Q2.1 | U3.17 27.55,3.69 27.18,4.06 27.18,5.84
  Top 0.508: 49.02,64.01 BMPC3.1 49.02,63.89 49.02,61.47 47.56,60.01 43.11,60.01 | U4.2 49.02,64.01 | 49.02,64.01 49.02,64.16 U4.3 | Q3.1 33.72,57.34 v34.04,57.66 | v27.43,6.35 27.43,6.1 27.18,5.84 25.65,4.32 25.65,3.81 24.64,2.79 FTC3.1
  Bottom 0.508: v40.89,62.23 38.61,62.23 v34.04,57.66 34.04,44.7 30.23,40.89 26.67,40.89 25.4,39.62 25.4,38.86 22.35,35.81 22.35,31.24 25.4,28.19 25.4,18.03 29.21,14.22 29.21,7.87 27.69,6.35 v27.43,6.35
5V  (via drill 0.6)
  Top 0.254: FTC2.A 23.88,5.09 24.13,5.33
  Top 0.381: IC4.7 59.36,20.65 59.44,20.57 | U3.20 29.5,6.05 | 29.5,6.05 29.46,6.1 | 19.56,25.15 19.6,25.11 IC2.1 21.8,25.11 21.84,25.15 | 29.5,6.05 29.97,5.59 32.51,5.59 33.27,6.35 33.27,7.11 32.77,7.62 32.77,8.72 U3.4
  Top 0.406: 29.46,6.1 28.19,7.37 26.16,7.37 | 18.67,26.04 19.56,25.15 | MAXC5.2 MAXC3.1 16.63,45.6 14.99,47.24 14.6,47.24 U1.16 | FTC2.A 23.75,6.34 24.52,7.11 | BMPR2.1 42.56,52.95 v43.43,52.07 | 26.16,7.37 25.91,7.11 24.52,7.11 | 26.16,7.37 24.38,9.14 24.38,10.67 | 24.52,7.11 24.27,7.37 FTC1.1
  Top 0.508: 38.1,15.24 38.1,14.99 | 38.1,14.99 38.1,14.09 ATC2.2 38.22,13.6 39.37,12.45 44.12,12.45 JP1.VBUS 45.75,10.92 46.48,10.92 47.75,9.65 47.75,5.08 52.07,0.76 57.91,0.76 58.65,1.5 D3.A D2.A D1.A 60.2,11.71 60.2,18.29 | ATR1.2 37.98,15.12 38.1,15.24 | ATR1.2 31.13,15.12 26.67,10.67 24.38,10.67 16.89,10.67 JP9.1 | 59.44,20.57 60.2,19.81 60.2,18.29 | 59.36,20.65 59.69,20.97 59.69,23 AMPC1.1 59.57,27.29 59.44,27.43 59.44,28.19 | IC3.8 54.1,37.47 | 54.1,37.47 54.74,37.47 55.82,38.55 SJ2.2 58.11,38.55 58.17,38.61 59.44,37.34 59.44,28.19 | 54.1,37.47 53.85,37.72 53.85,50.71 PKG-CABLE.1 52.43,52.07 v43.43,52.07 | J1.2 33.27,35.31 33.27,31.75 34.29,30.73 v35.56,30.73 38.35,30.73 38.9,30.19 IC1.38 38.9,27.22 38.86,27.18 39.37,26.67 v40.13,26.67 | ATL1.2 51.82,19.05 52.32,18.54 59.94,18.54 60.2,18.29 | IC5.BIAS 51.82,28.45 52.32,27.94 52.32,26.67 52.83,26.16 54.61,26.16 56.64,28.19 59.44,28.19 | ATR1.2 31.87,15.12 32,14.99 | v34.29,22.35 34.29,22.86 33.49,23.66 IC1.5 30.01,23.66 29.97,23.62 26.42,27.18 23.11,27.18 21.97,26.04 21.97,25.27 21.84,25.15 | IC1.17 38.1,15.24 | 38.1,14.99 38.61,15.49 42.67,15.49 43.18,16 43.18,17.78 42.42,18.54 42.42,20.57 41.66,21.34 v41.66,24.64 | 18.67,26.04 18.41,26.04 18.03,26.42 18.03,28.96 17.78,29.21 17.02,29.21 15.49,30.73 15.49,40.27 MAXC5.2 | BMPR4.1 38.22,55.26 v38.35,55.12
  Bottom 0.406: v38.35,55.12 41.4,52.07 v43.43,52.07
  Bottom 0.508: v34.29,22.35 35.56,23.62 v35.56,30.73 | v41.66,24.64 41.66,25.65 40.64,26.67 v40.13,26.67
EXT_CLK
  Top 0.508: JP2.2 29.39,21.26 IC1.8
GND  (via drill 0.6)
  Top 0.381: IC4.3 52.07,20 | 52.07,20 51.63,20 51.31,20.32 | IC4.4 52.72,19.35 52.07,20 | U3.26 33.41,2.92 33.27,3.05 32.76,2.53 U3.25 | U3.18 28.2,4.33 v28.45,4.57 | U3.21 30.16,2.72 30.48,3.05 | IC2.6 23.55,23.81 23.11,23.37 | IC2.3 22.42,23.81 22.61,23.62 | U3.7 30.8,10.09 30.48,10.41 v28.19,10.41
  Top 0.406: U1.15 14.1,48.64 13.21,47.75 v13.21,45.72 | U$2.1 33.49,61.94 34.54,62.99 v35.05,62.99 | U$2.7 29.39,61.28 v28.96,61.72 | U$2.5 30.52,59.98 29.46,58.93 v28.96,58.93
  Top 0.508: IC1.18 38.9,18.76 v38.61,19.05 | IC1.28 45.21,22.86 v45.72,23.37 | IC5.GND 54.68,27.5 55.63,28.45 55.63,28.96 55.88,29.21 57.4,29.21 57.91,29.72 57.91,30.34 RLED.1 | IC1.6 30.99,22.86 v30.73,22.61 | IC1.39 38.1,27.18 36.58,25.65 v34.29,25.65 | U4.7 v46.23,61.21
  other vias: 29.72,44.2 13.97,65.53 23.11,44.45 37.85,65.79 29.46,51.05 24.64,65.53 57.66,45.97 45.21,3.81 38.61,9.91 13.72,17.78 12.7,13.97 2.79,16.76 10.92,30.99 2.79,34.54 17.53,36.58 41.91,13.97 23.11,12.95 13.46,1.78 42.93,38.1 49.28,26.16 56.9,24.38 39.62,50.04 13.46,59.18 52.32,59.69 45.72,55.37 9.14,34.54 20.83,7.62 48.01,30.73 47.24,50.04 37.3,40.67 19.05,22.86
  pour Bottom (isolate 0.61): 0.76,66.8 60.45,66.55 60.45,0.51 0.51,0.51 0.51,66.8
  pour Top (isolate 0.61): 0.76,66.8 60.2,66.8 60.2,66.55 60.2,0.76 0.76,0.76
GPS_1PPS  (via drill 0.6)
  Top 0.381: GPS1PPS.S 17.78,8.13 v18.8,9.14
  Top 0.508: v18.8,9.14 GPR2.1 | IC1.15 36.5,18.87 36.07,19.3 34.54,19.3 31.75,16.51 31.24,16.51 28.45,13.72 v27.69,13.72
  Bottom 0.254: 27.43,13.72 v27.69,13.72
  Bottom 0.381: v18.8,9.14 22.61,9.14
  Bottom 0.406: 27.43,13.72 22.86,9.14 22.61,9.14
GPS_10MHZ
  Top 0.406: IC2.2 17.08,24.46
  Top 0.508: GPS10MHZ.S 16.14,25.4 GPR1.1 | GPR1.1 16.65,25.03 16.76,25.15 | 17.08,24.46 GPR1.1
GPS_CLK
  Top 0.381: IC2.7 27.61,24.46 27.69,24.38
  Top 0.508: JP2.1 28.19,23.37 28.19,24.13 27.94,24.13 27.69,24.38
GPS_RX  (via drill 0.6)
  Top 0.406: U1.12 16.13,52.45 v16.76,53.09
  Top 0.508: IC1.11 32.3,18.84 28.7,15.24 27.18,15.24 26.67,14.73 24.13,14.73 23.11,15.75 23.11,19.56 v21.59,21.08 | v16.51,27.69 14.22,29.97 v14.22,43.94
  Bottom 0.406: v14.22,43.94 16.76,46.48 v16.76,53.09
  Bottom 0.508: v21.59,21.08 18.8,21.08 16.51,23.37 v16.51,27.69
GPS_TX  (via drill 0.6)
  Top 0.406: 14.35,53.59 14.73,53.59 15.49,54.36 v18.03,54.36 | 14.22,53.59 14.35,53.59 | 14.35,53.59 U1.11
  Top 0.508: IC1.12 33.82,17.06 v33.02,16.26 | v12.95,40.89 12.95,28.96 v14.22,27.69
  Bottom 0.381: v12.95,40.89 18.03,45.97 v18.03,54.36 | 22.1,4.57 22.61,4.06 26.92,4.06 28.19,2.79 30.99,2.79 32.51,4.32 32.51,5.59 33.02,6.1 v33.02,16.26
  Bottom 0.508: 22.1,4.57 18.8,7.87 15.49,7.87 14.22,9.14 14.22,16.26 15.24,17.27 15.24,18.29 14.22,19.3 v14.22,27.69
GREEN_LED
  Top 0.381: IC1.23 44.13,18.86 44.45,18.54 ATR4.2
I2C_SCL  (via drill 0.6)
  Top 0.406: BMPR2.2 Q2.3
  Top 0.508: IC1.19 39.7,21.01 v39.12,21.59 | v37.59,32.51 37.59,36.58 35.81,38.35 35.81,42.16 34.8,43.18 34.8,48.51 41.03,54.75 BMPR2.2
  Bottom 0.508: v37.59,32.51 39.12,30.99 v39.12,21.59
I2C_SDA  (via drill 0.6)
  Top 0.508: IC1.20 40.5,19.16 v41.15,19.81 | v35.56,32.51 35.56,36.58 32.77,39.37 32.77,49.53 | Q3.3 32.77,53.59 32.9,53.46 32.82,53.46 Q3.3 | 32.77,49.53 Q3.3 | BMPR4.2 36.07,52.83 32.77,49.53
  Bottom 0.508: v41.15,19.81 40.64,20.32 38.35,20.32 37.59,21.08 37.59,30.48 v35.56,32.51
IR_CATHODE  (via drill 0.6)
  Top 0.381: 50.29,29.97 50.29,30.73 50.8,31.24 v52.83,31.24
  Top 0.508: IC5.OUT 50.87,29.4 50.29,29.97
  Bottom 0.381: v52.83,31.24 52.83,45.21 54.1,46.48 54.1,47.86 PKG-CABLE.2
IR_PWM
  Top 0.381: Q1.1 43.32,28.08 37.59,22.35 37.59,19.56 37.3,19.27 IC1.16
LOCAL_CLK
  Top 0.508: JP2.3 26.28,17.78 U2.P$3
MISO  (via drill 0.6)
  Top 0.508: IC1.2 31.34,26.06 29.97,27.43 29.97,28.45 v30.73,29.21
  Bottom 0.508: v30.73,29.21 26.92,29.21 23.88,32.26 23.88,34.29 27.69,38.1 J1.1
MOSI
  Top 0.508: J1.4 31.24,35.56 32.26,34.54 32.26,28.96 31.24,27.94 31.24,27.43 31.77,26.9 32.26,26.9 IC1.1
N$1
  Top 0.508: Q1.3 51.06,27.43 IC5.EN
N$2
  Top 0.508: RLED.2 55.63,30.48 54.61,29.46 | 54.61,29.46 53.59,29.46 IC5.REXT | IC5.FB 54.36,28.45 54.61,28.7 54.61,29.46
N$3
  Top 0.406: U1.1 23.86,47.37 MAXC1.2
N$4
  Top 0.406: MAXC1.1 23.76,49.28 21.84,49.28 21.21,49.91 U1.3
N$5
  Top 0.406: U1.4 20.08,51.17 MAXC2.2
N$6
  Top 0.406: MAXC2.1 20.97,52.97 20.57,52.58 20.2,52.58 U1.5
N$7
  Top 0.406: MAXC3.2 18.43,47.64 19.3,48.51 19.95,48.51 U1.2
N$8  (via drill 0.6)
  Top 0.406: U1.14 13.84,49.53 v12.95,49.53
  Bottom 0.406: X2.2 12.95,52.2 v12.95,49.53
N$9
  Top 0.406: U1.6 20.45,53.72 20.83,54.1 21.47,54.1 MAXC4.1
N$10
  Top 0.406: U1.13 11.2,51.18 X2.3
N$11  (via drill 0.6)
  Top 0.381: U3.16 26.91,2.56 v26.42,3.05
  Bottom 0.381: v26.42,3.05 26.42,2.29 27.18,1.52 40.89,1.52 41.66,2.29 41.66,9.33 JP1.D-
N$12  (via drill 0.6)
  Top 0.381: U3.15 26.25,1.36 25.91,1.02 24.89,1.02 v24.38,1.52
  Bottom 0.381: v24.38,1.52 25.15,0.76 41.15,0.76 42.42,2.03 42.42,8.11 JP1.D+
N$13
  Top 0.508: IC1.27 46.89,22.06 ATC3.2 ATL1.1
N$14
  Top 0.508: IC3.6 56.06,34.92 SJ1.2
N$15  (via drill 0.6)
  Top 0.406: U$2.4 33.49,59.98 34.54,58.93 37.59,58.93 39.12,60.45 | Q2.2 41.15,58.44 41.15,58.42 39.12,60.45 | 39.12,60.45 BMPR1.2 | 44.7,64.01 U4.5
  Top 0.508: 41.15,58.42 v41.15,60.2 | 44.7,64.01 43.43,64.01 42.42,65.02 v41.4,65.02
  Bottom 0.508: v41.15,60.2 43.69,60.2 44.7,61.21 44.7,62.74 42.42,65.02 v41.4,65.02
N$16
  Top 0.508: ATR4.1 44.59,14.34 46.74,12.19 51.82,12.19 52.83,11.18 52.83,7.62 53.85,6.6 53.85,4.34 D3.C
N$17
  Top 0.508: IC3.7 55.7,36.2 SJ2.1
N$19
  Top 0.508: IC3.2 45.34,36.2 44.9,35.76 SJ3.2
N$20
  Top 0.508: ATR3.1 46.99,13.72 47.5,13.21 52.32,13.21 53.85,11.68 53.85,8.15 D2.C
N$21
  Top 0.508: ATR2.1 52.72,14.34 55.37,11.68 55.37,10.44 D1.C
N$22
  Top 0.508: ATC4.2 20.83,19.44 20.83,17.53 20.32,17.02 U2.P$4 U2.P$1 JP9.2
N$23  (via drill 0.6)
  Top 0.406: U$2.3 34.62,60.63 v35.05,60.2 36.07,60.2 36.44,60.57 BMPR3.2 | BMPR3.2 36.83,60.45 | BMPR3.2 36.83,60.71
  Top 0.508: Q3.2 v31.75,57.66 | v43.18,61.98 43.69,62.48 44.78,62.48 U4.6
  Bottom 0.508: v31.75,57.66 32.51,57.66 v35.05,60.2 38.35,63.5 41.91,63.5 43.18,62.23 v43.18,61.98
PD_AMP_OUT
  Top 0.381: 55.51,25.03 55.37,25.03 | 55.37,25.03 RFB.1 CFB.2 46.6,25.03 45.47,26.16 45.47,26.67 45.28,26.86 IC1.33 | IC4.6 56.97,20 55.63,21.34 55.63,24.64 55.63,24.78 55.37,25.03
  Top 0.406: 55.63,25.65 55.63,24.64
  Top 0.508: 55.51,25.03 55.51,25.54 55.63,25.65 56.39,26.42 PDOUT.1
PD_CATHODE  (via drill 0.6)
  Top 0.381: IC4.2 52.51,20.65 52.07,21.08 52.07,22.98 51.82,23.23 | v50.55,21.59 50.55,22.98 CFB.1
  Top 0.508: CFB.1 51.82,23.23 RFB.2
  Bottom 0.381: PKG-CABLE.3 52.42,54.2 50.8,52.58 50.8,48.51 51.31,48.01 51.31,22.35 v50.55,21.59
RED_LED
  Top 0.381: IC1.25 46.09,20.46 46.23,20.32 46.23,18.29 46.74,17.78 49.02,17.78 49.53,17.27 ATR2.2
RESET  (via drill 0.6)
  Top 0.381: ATR1.1 35.93,13.32 v36.07,13.46 | v36.07,22.1 33.71,24.46 IC1.4
  Top 0.508: ATR1.1 34.01,13.32 ATC1.2 | IC1.4 30.4,24.46 27.94,26.92 J1.5
  Bottom 0.381: v36.07,13.46 v36.07,22.1
SCK  (via drill 0.6)
  Top 0.508: IC1.3 30.87,25.26 28.96,27.18 28.96,29.97 v29.46,30.48
  Bottom 0.508: v29.46,30.48 27.43,30.48 25.65,32.26 25.65,34.04 26.67,35.05 27.43,35.05 J1.3
TP1
  Top 0.508: IC1.37 39.7,32.44 38.86,33.27 38.86,45.34 JP3.2
TP2
  Top 0.508: IC1.36 40.5,32.91 40.13,33.27 40.13,44.32 JP3.3
TP3
  Top 0.508: IC1.35 41.3,42.7 JP3.4
USB_DTR
  Top 0.381: U3.2 34.05,11.53 ATC1.1
USB_RX  (via drill 0.6)
  Top 0.381: v34.54,20.83 34.18,20.46 IC1.9
  Top 0.406: v30.73,4.57 32.77,4.57 34.7,6.51 U3.1
  Bottom 0.381: 32,18.29 v34.54,20.83
  Bottom 0.406: 32,18.29 32,6.35 31.75,6.1 31.75,5.08 31.24,4.57 v30.73,4.57
USB_TX  (via drill 0.6)
  Top 0.381: v30.23,19.05 30.84,19.66 IC1.10
  Top 0.406: v30.73,6.86 31.24,6.86 32.1,7.72 U3.5
  Bottom 0.381: v30.73,6.86 30.73,18.54 v30.23,19.05
VTEMP
  Top 0.406: IC3.1 49.44,39.99 VTEMP.1 49.44,44.38 PKG-CABLE.4
  Top 0.508: IC1.34 42.18,28.66 SJ3.1 44,36.63 44.83,37.47 IC3.1
YELLOW_LED
  Top 0.381: IC1.24 45.36,19.66 45.47,19.56 45.47,18.03 46.74,16.76 46.74,16.39 ATR3.2

### Text on the board
tPlace: GND | 1 | 2 | 3 | github.com/dkirkby/ticktock | v2.0
tNames: GPS | RS232 | SENSOR / BLOCK | CLK / SEL | MCU | GPS | XTAL | PWR XTAL | FTDI